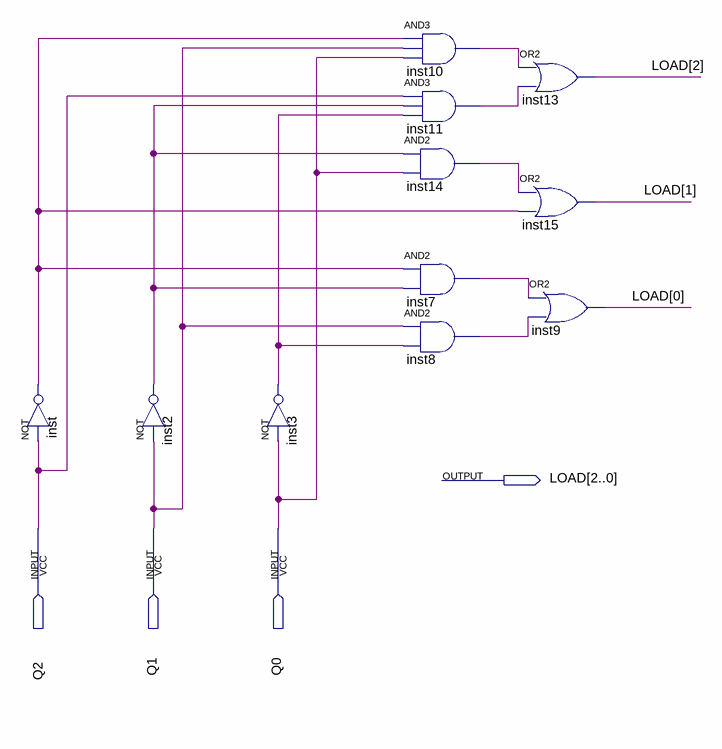
[diagram p0: schematic sheet]
// Quartus schematic LOAD_C0.bdf as structural Verilog: 11 symbols, 4 pins
module LOAD_C0 (
  input  Q2,
  input  Q1,
  input  Q0,
  output [2:0] LOAD
);

  wire inst2_out, inst3_out, inst7_out, inst8_out, inst10_out, inst11_out, inst14_out, inst_out;

  not inst (inst_out, Q2);
  not inst2 (inst2_out, Q1);
  not inst3 (inst3_out, Q0);
  and inst10 (inst10_out, inst_out, Q1, Q0);
  and inst11 (inst11_out, Q2, inst2_out, inst3_out);
  and inst14 (inst14_out, inst2_out, Q0);
  and inst7 (inst7_out, inst_out, inst2_out);
  and inst8 (inst8_out, Q1, inst3_out);
  or inst13 (LOAD[2], inst10_out, inst11_out);
  or inst15 (LOAD[1], inst14_out, inst_out);
  or inst9 (LOAD[0], inst7_out, inst8_out);
endmodule
